# EAGLE design Rev1_7 (EAGLE 9.0.1)
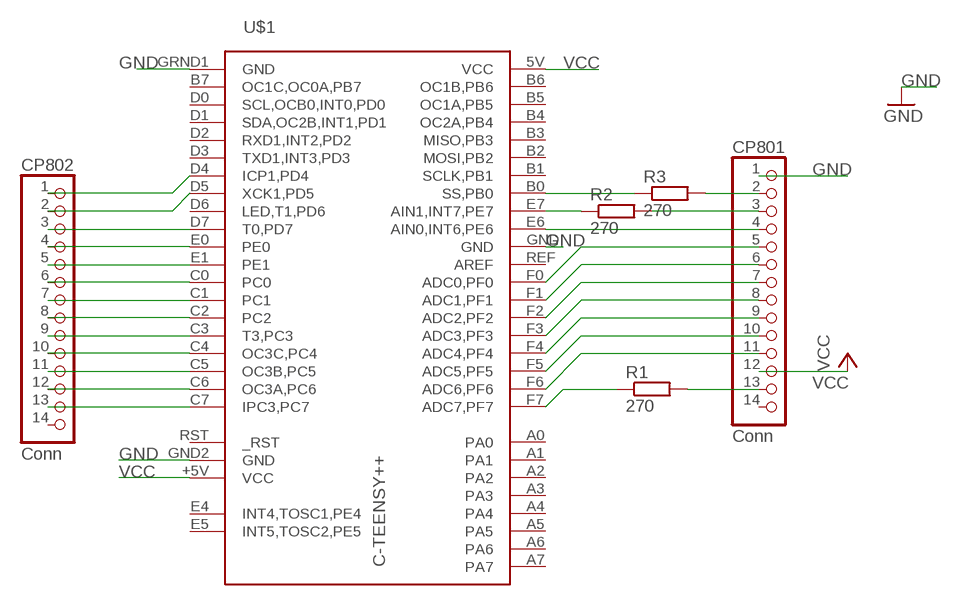
[diagram p0: schematic, sheet 1]

## Parts
CP801  Conn  PINHD-1X14  [1X14]
CP802  Conn  PINHD-1X14  [1X14]
R1  270  R-EU_R0805  [R0805]
R2  270  R-EU_R0805  [R0805]
R3  270  R-EU_R0805  [R0805]
U$1  C-TEENSY++  [TEENSY++]

## Nets
GND: CP801.1 U$1.GND U$1.GND2(GND) U$1.GRND1(GND)
N$1: CP801.11 U$1.F6(ADC6,PF6)
N$2: CP802.13 U$1.C7(IPC3,PC7)
N$3: CP801.10 U$1.F5(ADC5,PF5)
N$4: CP801.9 U$1.F4(ADC4,PF4)
N$5: CP801.8 U$1.F3(ADC3,PF3)
N$6: CP801.7 U$1.F2(ADC2,PF2)
N$7: CP801.6 U$1.F1(ADC1,PF1)
N$8: CP801.5 U$1.F0(ADC0,PF0)
N$9: CP801.4 U$1.E6(AIN0,INT6,PE6)
N$10: CP802.12 U$1.C6(OC3A,PC6)
N$11: CP802.11 U$1.C5(OC3B,PC5)
N$12: CP802.10 U$1.C4(OC3C,PC4)
N$13: CP802.9 U$1.C3(T3,PC3)
N$14: CP802.8 U$1.C2
N$15: CP802.7 U$1.C1
N$16: CP802.6 U$1.C0
N$17: CP802.5 U$1.E1
N$18: CP802.4 U$1.E0
N$19: CP802.3 U$1.D7(T0,PD7)
N$20: CP802.2 U$1.D5(XCK1,PD5)
N$21: CP802.1 U$1.D4(ICP1,PD4)
N$22: CP801.3 R2.2
N$23: R2.1 U$1.E7(AIN1,INT7,PE7)
N$24: R3.1 U$1.B0(SS,PB0)
N$25: CP801.2 R3.2
N$26: R1.1 U$1.F7(ADC7,PF7)
N$27: CP801.13 R1.2
VCC [VCC]: CP801.12 U$1.5V(VCC) U$1.+5V(VCC)
Unconnected: CP801.14 CP802.14 U$1.A0 U$1.A1 U$1.A2 U$1.A3 U$1.A4 U$1.A5 U$1.A6 U$1.A7 U$1.B1(SCLK,PB1) U$1.B2(MOSI,PB2) U$1.B3(MISO,PB3) U$1.B4(OC2A,PB4) U$1.B5(OC1A,PB5) U$1.B6(OC1B,PB6) U$1.B7(OC1C,OC0A,PB7) U$1.D0(SCL,OCB0,INT0,PD0) U$1.D1(SDA,OC2B,INT1,PD1) U$1.D2(RXD1,INT2,PD2) U$1.D3(TXD1,INT3,PD3) U$1.D6(LED,T1,PD6) U$1.E4(INT4,TOSC1,PE4) U$1.E5(INT5,TOSC2,PE5) U$1.REF(AREF) U$1.RST(_RST)

## Library data of the parts
CP801 CP802 = pinhead:PINHD-1X14: PIN HEADER
R1-R3 = resistor:R-EU_: RESISTOR, European symbol
U$1 = teensypp:C-TEENSY++

## Net classes
0 default: width 0.203 mm
1 VCC: width 0.305 mm
2 GND: width 0.305 mm

## Board
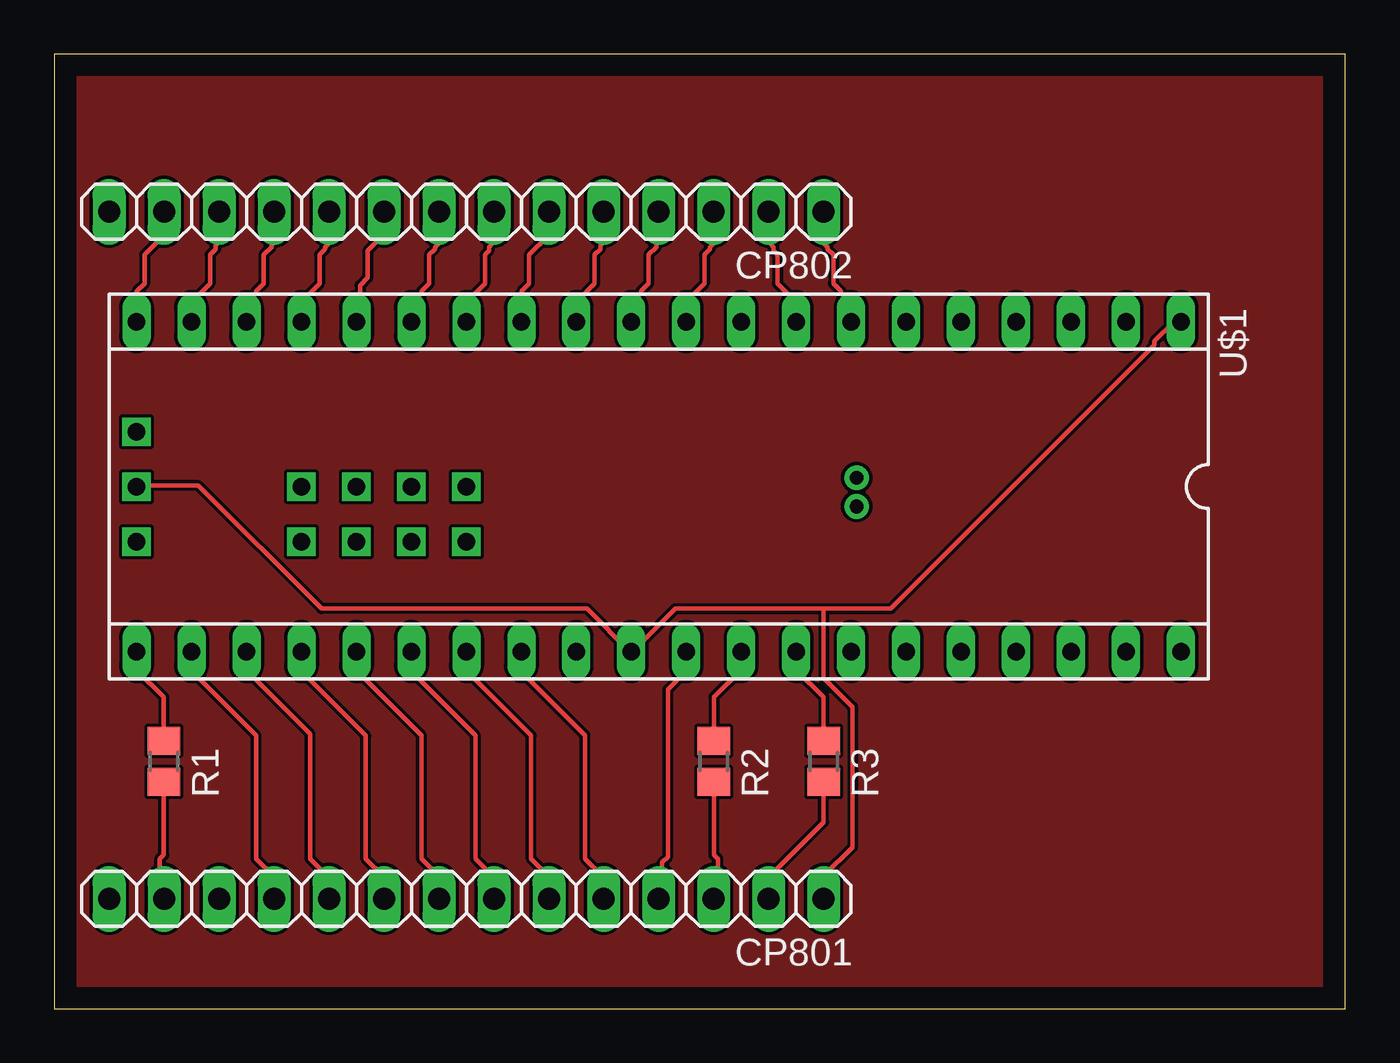
[diagram p1: board, top side]
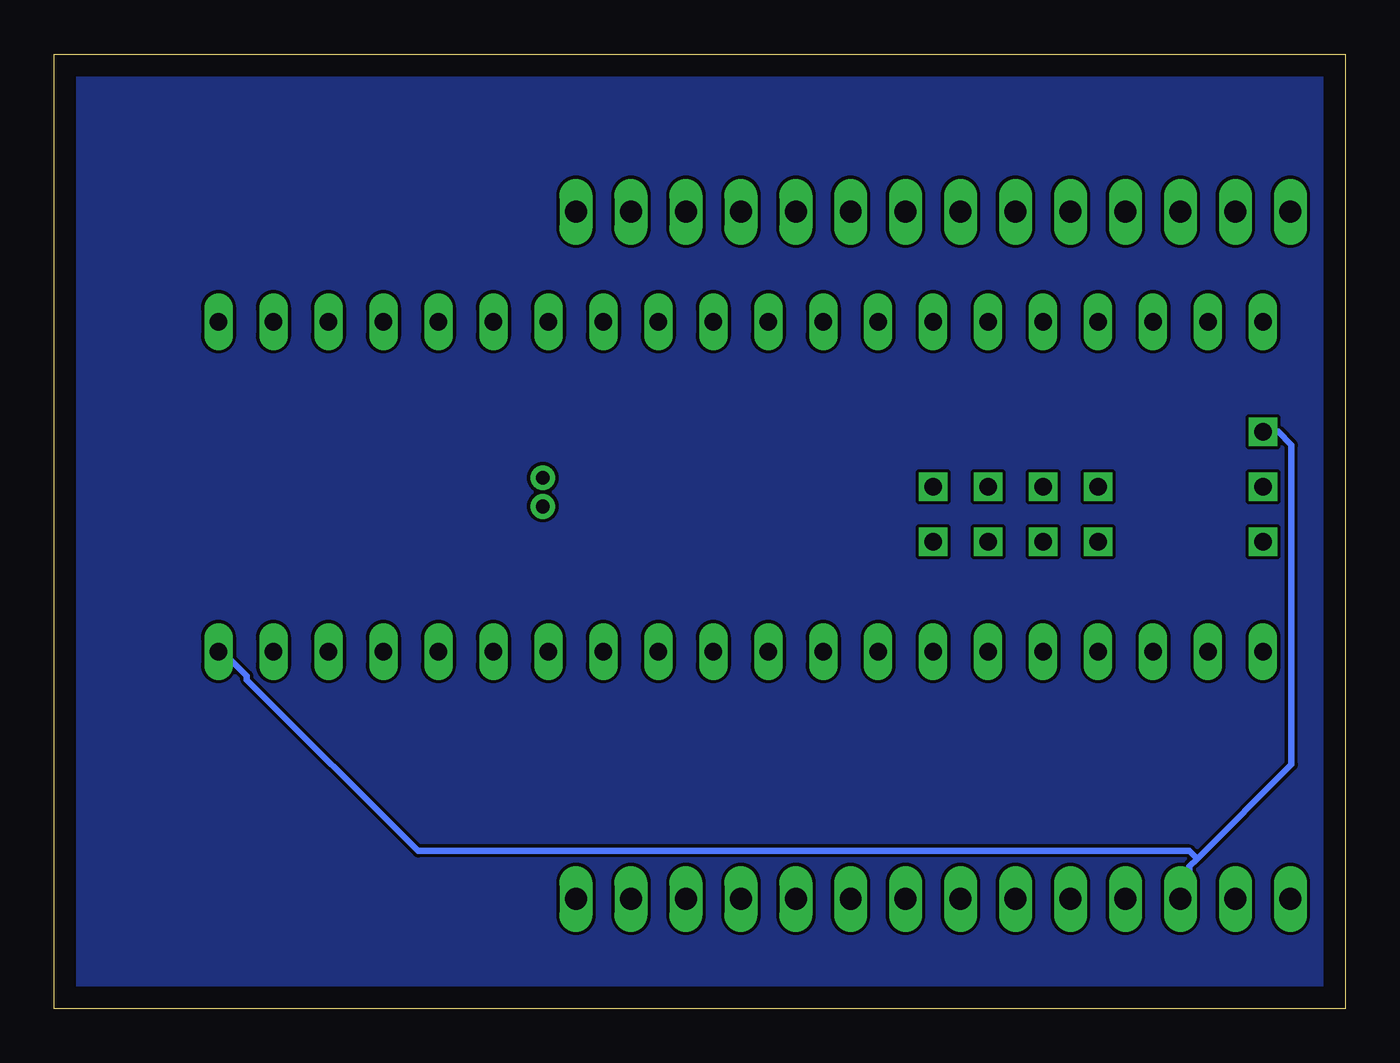
[diagram p2: board, bottom side, seen from below]

Size 59.67 x 44.12 mm. Coordinates in mm from the lower left corner, seen from the top.
Outline: 0,0 59.67,0 59.67,44.12 0,44.12 0,0
Copper layers (1*16): Top 0.035mm / dielectric 1.5mm / Bottom 0.035mm
Design rules "default": minimum track width 6mil, minimum drill 0.35mm, track to track 6mil, track to pad 6mil, pad to pad 6mil, via to via 6mil, smd to smd 6mil, copper to edge 40mil, drill to drill 6mil, minimum pad ring 10mil, minimum via ring 8mil, stop-mask expansion 4mil, vias tented up to drill 0mil, thermal gap 10mil

### Footprints (pad centres in the part's own frame; a part is rotated, then mirrored left to right if it is on the bottom)
1X14 = drill 1.016 long: 1 -16.51,0; 2 -13.97,0; 3 -11.43,0; 4 -8.89,0; 5 -6.35,0; 6 -3.81,0; 7 -1.27,0; 8 1.27,0; 9 3.81,0; 10 6.35,0; 11 8.89,0; 12 11.43,0; 13 13.97,0; 14 16.51,0
R0805 = smd 1.3 x 1.5: 1 -0.95,0; 2 0.95,0
TEENSY++ = drill 0.8 square: 5V 24.13,-2.54; A0 8.89,0; A1 11.43,0; A2 13.97,0; A3 16.51,0; A4 8.89,2.54; A5 11.43,2.54; A6 13.97,2.54; A7 16.51,2.54; GND2 24.13,0; RST 24.13,2.54 | drill 0.813 long: +5V -24.13,7.62; B0 -6.35,7.62; B1 -8.89,7.62; B2 -11.43,7.62; B3 -13.97,7.62; B4 -16.51,7.62; B5 -19.05,7.62; B6 -21.59,7.62; B7 -21.59,-7.62; C0 6.35,-7.62; C1 8.89,-7.62; C2 11.43,-7.62; C3 13.97,-7.62; C4 16.51,-7.62; C5 19.05,-7.62; C6 21.59,-7.62; C7 24.13,-7.62; D0 -19.05,-7.62; D1 -16.51,-7.62; D2 -13.97,-7.62; D3 -11.43,-7.62; D4 -8.89,-7.62; D5 -6.35,-7.62; D6 -3.81,-7.62; D7 -1.27,-7.62; E0 1.27,-7.62; E1 3.81,-7.62; E6 -1.27,7.62; E7 -3.81,7.62; F0 6.35,7.62; F1 8.89,7.62; F2 11.43,7.62; F3 13.97,7.62; F4 16.51,7.62; F5 19.05,7.62; F6 21.59,7.62; F7 24.13,7.62; GND -24.13,-7.62; GRND1 1.27,7.62; REF 3.81,7.62 | drill 0.635 pad 1.067: E4 -9.144,0.914; E5 -9.144,-0.406

### Placement (x,y rotation side)
CP801  19.05,5.08 180 top
CP802  19.05,36.83 180 top
R1  5.08,11.43 270 top
R2  30.48,11.43 270 top
R3  35.56,11.43 270 top
U$1  27.94,24.13 180 top

### Tracks (layer width: path | path; a pad name or v marks a point on that pad's centre or on a via)
GND
  Top 0.203: U$1.GND2 3.82,24.18 6.67,24.18 12.36,18.49 24.62,18.49 26.67,16.45 U$1.GRND1 26.76,16.54 28.71,18.49 35.56,18.49 | 35.56,18.49 38.67,18.49 50.85,30.67 50.85,30.85 51.74,31.74 52.01,31.74 U$1.GND | CP801.1 35.56,6.13 36.89,7.47 36.89,13.96 35.56,15.29 35.56,18.49
N$1
  Top 0.203: U$1.F6 6.4,16.45 6.4,15.56 9.34,12.62 9.34,6.93 10.13,6.13 10.13,5.16 CP801.11
N$2
  Top 0.203: U$1.C7 3.82,31.83 3.82,33.16 4.18,33.52 4.18,34.85 5.07,35.74 5.07,36.8 CP802.13
N$3
  Top 0.203: U$1.F5 8.89,15.65 11.82,12.71 11.82,6.93 12.62,6.13 12.62,5.16 CP801.10
N$4
  Top 0.203: U$1.F4 11.47,16.45 11.47,15.56 14.4,12.62 14.4,6.93 15.2,6.13 15.2,5.16 CP801.9
N$5
  Top 0.203: CP801.8 17.78,6.13 16.98,6.93 16.98,12.62 14.05,15.56 14.05,16.45 U$1.F3
N$6
  Top 0.203: U$1.F2 16.54,16.45 16.54,15.56 19.47,12.62 19.47,6.93 20.27,6.13 20.27,5.16 CP801.7
N$7
  Top 0.203: U$1.F1 19.11,16.45 19.11,15.56 22.05,12.62 22.05,6.93 22.85,6.13 22.85,5.16 CP801.6
N$8
  Top 0.203: U$1.F0 21.6,16.45 21.6,15.56 24.54,12.62 24.54,6.93 25.34,6.13 25.34,5.16 CP801.5
N$9
  Top 0.203: U$1.E6 29.16,16.45 29.16,15.56 28.36,14.76 28.36,7.02 28.09,6.76 28.09,5.25 28,5.16 CP801.4
N$10
  Top 0.203: U$1.C6 6.4,31.83 6.4,32.72 7.2,33.52 7.2,34.85 7.47,35.12 7.47,35.29 7.56,35.38 7.56,36.8 CP802.12
N$11
  Top 0.203: U$1.C5 8.89,32.63 9.34,33.07 9.34,33.16 9.69,33.52 9.69,34.85 10.05,35.2 10.05,35.29 10.13,35.38 10.13,36.8 CP802.11
N$12
  Top 0.203: U$1.C4 11.47,31.83 11.47,32.72 12.27,33.52 12.27,34.85 12.54,35.12 12.54,35.2 12.71,35.38 12.71,36.8 CP802.10
N$13
  Top 0.203: U$1.C3 14.05,31.83 14.05,32.98 14.13,33.07 14.13,33.43 14.49,33.78 14.49,35.03 15.2,35.74 15.2,36.8 CP802.9
N$14
  Top 0.203: CP802.8 17.78,35.38 17.6,35.2 17.6,35.12 17.34,34.85 17.34,33.52 16.98,33.16 16.98,33.07 16.54,32.63 16.54,31.83 U$1.C2
N$15
  Top 0.203: U$1.C1 19.11,31.83 19.11,32.72 19.91,33.52 19.91,34.85 20.09,35.03 20.09,35.2 20.27,35.38 20.27,36.8 CP802.7
N$16
  Top 0.203: U$1.C0 21.6,31.83 21.6,33.16 21.96,33.52 21.96,34.85 22.85,35.74 22.85,36.8 CP802.6
N$17
  Top 0.203: U$1.E1 24.18,31.83 24.18,32.72 24.98,33.52 24.98,34.85 25.25,35.12 25.25,35.29 25.34,35.38 25.34,36.8 CP802.5
N$18
  Top 0.203: U$1.E0 26.67,32.63 27.11,33.07 27.11,33.16 27.47,33.52 27.47,34.85 27.83,35.2 27.83,35.29 27.91,35.38 27.91,36.8 CP802.4
N$19
  Top 0.203: U$1.D7 29.25,31.83 29.25,32.72 30.05,33.52 30.05,34.85 30.32,35.12 30.32,35.2 30.49,35.38 30.49,36.8 CP802.3
N$20
  Top 0.203: U$1.D5 34.23,31.83 34.23,32.72 33.43,33.52 33.43,34.85 33.25,35.03 33.25,35.2 33.07,35.38 33.07,36.8 CP802.2
N$21
  Top 0.203: CP802.1 35.56,35.38 35.74,35.2 35.74,35.12 36.01,34.85 36.01,33.52 36.36,33.16 36.36,33.07 36.8,32.63 36.8,31.83 U$1.D4
N$22
  Top 0.203: R2.2 30.49,10.4 30.49,7.11 30.67,6.93 30.67,6.58 30.49,6.4 30.49,5.16 CP801.3
N$23
  Top 0.203: R2.1 30.49,12.45 30.49,14.4 31.74,15.65 31.74,16.45 U$1.E7
N$24
  Top 0.203: R3.1 35.56,14.4 34.31,15.65 34.31,16.45 U$1.B0
N$25
  Top 0.203: R3.2 35.56,8.62 33.07,6.13 33.07,5.16 CP801.2
N$26
  Top 0.203: R1.1 5.07,12.45 5.07,14.4 3.82,15.65 3.82,16.45 U$1.F7
N$27
  Top 0.203: R1.2 5.07,10.4 5.07,7.11 4.89,6.93 4.89,6.58 5.07,6.4 5.07,5.16 CP801.13
N$28
  pour Top: 0,0 0,44.45 59.69,44.45 59.69,0
N$29
  pour Bottom: 0,0 0,44.45 59.69,44.45 59.69,0
VCC
  Bottom 0.305: U$1.5V 3.11,26.67 2.49,26.05 2.49,11.29 6.84,6.93 | 6.84,6.93 7.2,6.58 7.2,6.4 7.56,6.04 7.56,5.16 CP801.12 | 6.84,6.93 7.2,7.29 42.85,7.29 50.76,15.2 50.76,15.38 51.83,16.45 52.01,16.45 U$1.+5V

### Text on the board
tValues: Tygr Labs / PPC640 / Keyboard / Converter / v1.7